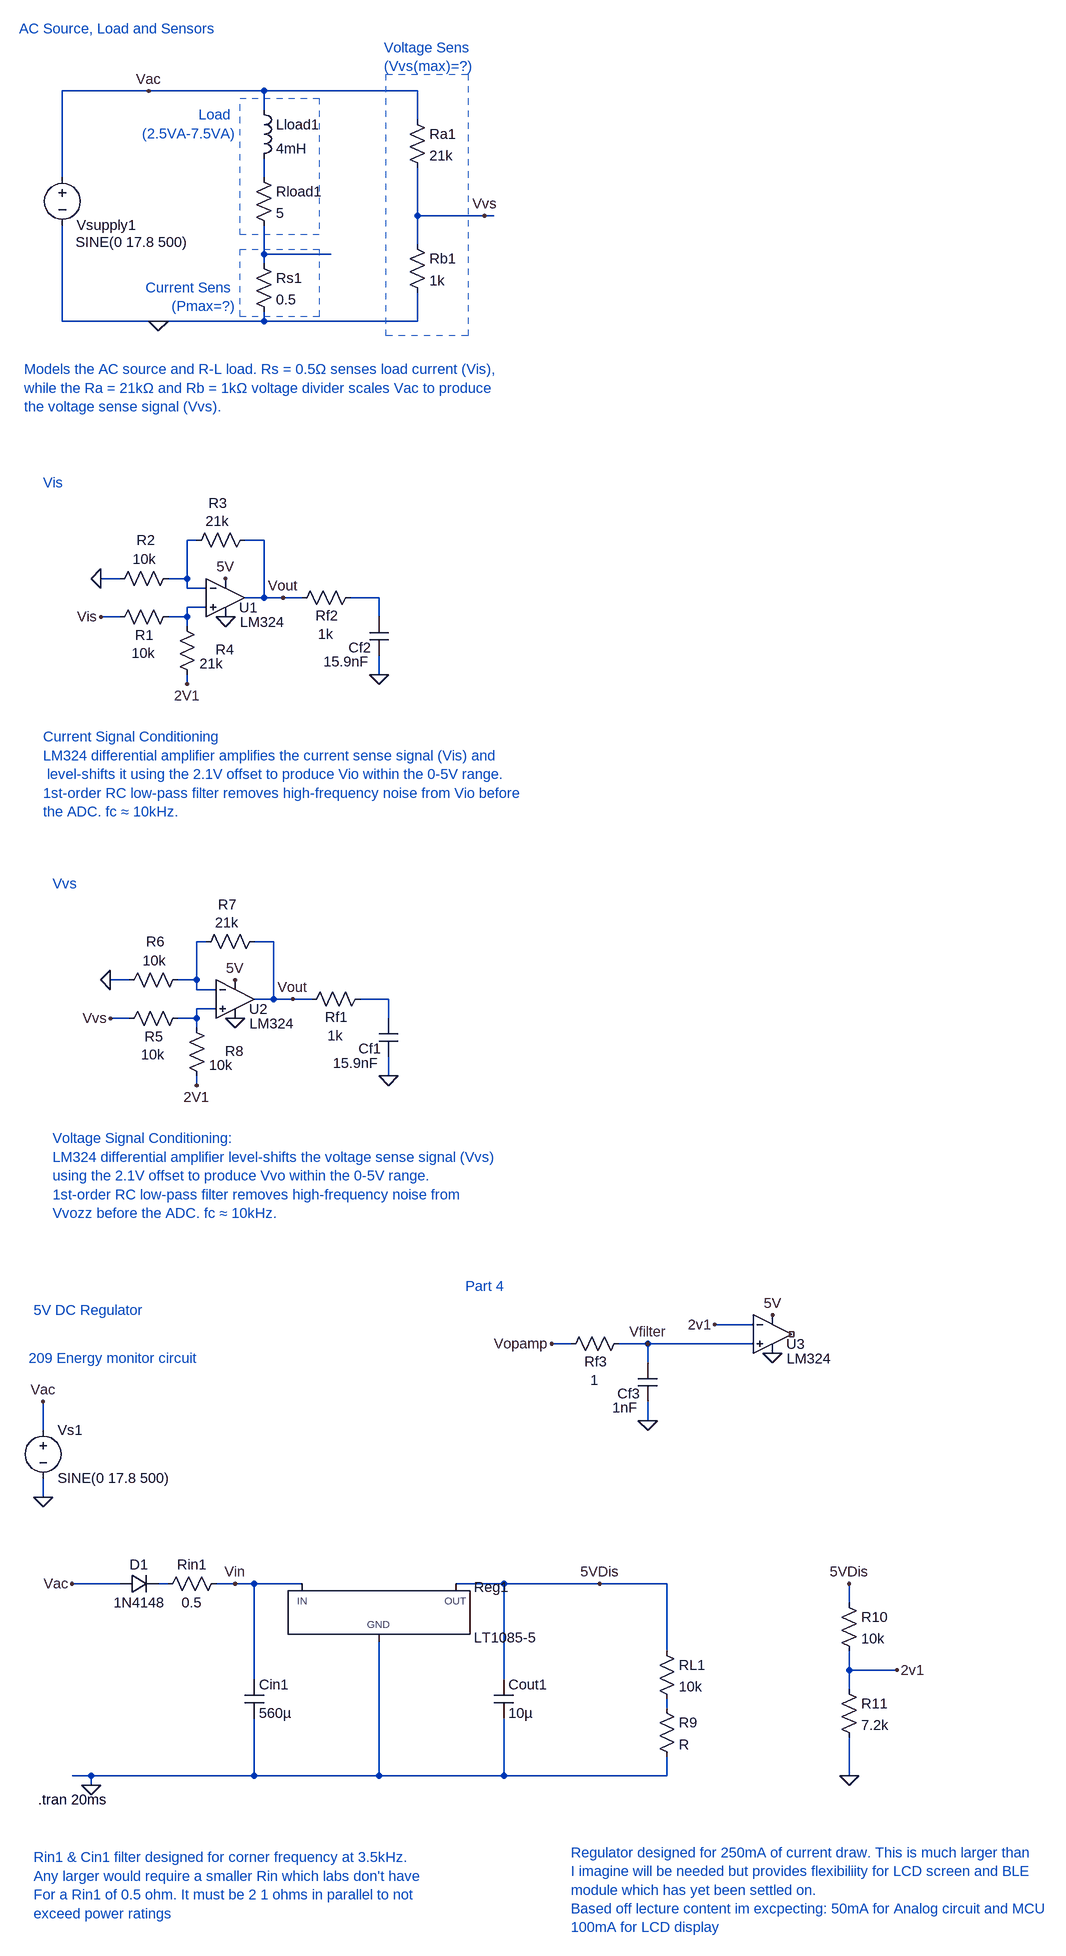
[diagram p0: schematic FinalFinalAnalogDesign.asc]
FinalFinalAnalogDesign.asc, the LTspice schematic file:
Version 4.1
SHEET 1 1692 1584
WIRE -144 -1760 -288 -1760
WIRE 48 -1760 -144 -1760
WIRE 304 -1760 48 -1760
WIRE 48 -1728 48 -1760
WIRE 304 -1712 304 -1760
WIRE -288 -1616 -288 -1760
WIRE 48 -1616 48 -1648
WIRE 304 -1552 304 -1632
WIRE 416 -1552 304 -1552
WIRE 432 -1552 416 -1552
WIRE 304 -1504 304 -1552
WIRE 48 -1488 48 -1536
WIRE 160 -1488 48 -1488
WIRE 48 -1472 48 -1488
WIRE -288 -1376 -288 -1536
WIRE -128 -1376 -288 -1376
WIRE 48 -1376 48 -1392
WIRE 48 -1376 -128 -1376
WIRE 304 -1376 304 -1424
WIRE 304 -1376 48 -1376
WIRE -64 -928 -80 -928
WIRE 48 -928 16 -928
WIRE -192 -864 -224 -864
WIRE -80 -864 -80 -928
WIRE -80 -864 -112 -864
WIRE -80 -848 -80 -864
WIRE -48 -848 -80 -848
WIRE 48 -832 48 -928
WIRE 48 -832 16 -832
WIRE 80 -832 48 -832
WIRE 112 -832 80 -832
WIRE 240 -832 192 -832
WIRE -48 -816 -80 -816
WIRE -192 -800 -224 -800
WIRE -80 -800 -80 -816
WIRE -80 -800 -112 -800
WIRE 240 -800 240 -832
WIRE -80 -784 -80 -800
WIRE 240 -704 240 -736
WIRE -80 -688 -80 -704
WIRE -48 -144 -64 -144
WIRE 64 -144 32 -144
WIRE -176 -80 -208 -80
WIRE -64 -80 -64 -144
WIRE -64 -80 -96 -80
WIRE -64 -64 -64 -80
WIRE -32 -64 -64 -64
WIRE 64 -48 64 -144
WIRE 64 -48 32 -48
WIRE 96 -48 64 -48
WIRE 128 -48 96 -48
WIRE 256 -48 208 -48
WIRE -32 -32 -64 -32
WIRE -176 -16 -208 -16
WIRE -64 -16 -64 -32
WIRE -64 -16 -96 -16
WIRE 256 -16 256 -48
WIRE -64 0 -64 -16
WIRE 256 80 256 48
WIRE -64 96 -64 80
WIRE 864 576 800 576
WIRE 560 608 528 608
WIRE 688 608 640 608
WIRE 864 608 688 608
WIRE 688 640 688 608
WIRE 688 736 688 704
WIRE -320 752 -320 704
WIRE -320 864 -320 832
WIRE -192 1008 -272 1008
WIRE -112 1008 -128 1008
WIRE 0 1008 -32 1008
WIRE 32 1008 0 1008
WIRE 112 1008 32 1008
WIRE 448 1008 368 1008
WIRE 608 1008 448 1008
WIRE 720 1008 608 1008
WIRE 1024 1040 1024 1008
WIRE 720 1120 720 1008
WIRE 1024 1152 1024 1120
WIRE 1104 1152 1024 1152
WIRE 32 1168 32 1008
WIRE 448 1168 448 1008
WIRE 1024 1184 1024 1152
WIRE 720 1216 720 1200
WIRE -240 1328 -272 1328
WIRE 32 1328 32 1232
WIRE 32 1328 -240 1328
WIRE 240 1328 240 1104
WIRE 240 1328 32 1328
WIRE 448 1328 448 1232
WIRE 448 1328 240 1328
WIRE 720 1328 720 1296
WIRE 720 1328 448 1328
WIRE 1024 1328 1024 1264
WIRE -240 1344 -240 1328
FLAG -128 -1376 0
FLAG -144 -1760 Vac
FLAG 416 -1552 Vvs
FLAG -16 -800 0
FLAG -16 -864 5V
FLAG -224 -800 Vis
FLAG -224 -864 0
FLAG -80 -688 2V1
FLAG 0 -16 0
FLAG 0 -80 5V
FLAG -208 -16 Vvs
FLAG -208 -80 0
FLAG -64 96 2V1
FLAG 256 80 0
FLAG 240 -704 0
FLAG 96 -48 Vout
FLAG 80 -832 Vout
FLAG -240 1344 0
FLAG -272 1008 Vac
FLAG 608 1008 5VDis
FLAG 0 1008 Vin
FLAG -320 864 0
FLAG -320 704 Vac
FLAG 688 736 0
FLAG 528 608 Vopamp
FLAG 896 624 0
FLAG 896 560 5V
FLAG 1024 1328 0
FLAG 1024 1008 5VDis
FLAG 1104 1152 2v1
FLAG 688 608 Vfilter
FLAG 800 576 2v1
DATAFLAG 32 1008 ""
SYMBOL voltage -288 -1632 R0
WINDOW 0 24 96 Left 2
WINDOW 3 22 124 Left 2
WINDOW 123 0 0 Left 0
WINDOW 39 0 0 Left 0
SYMATTR InstName Vsupply1
SYMATTR Value SINE(0 17.8 500)
SYMBOL res 32 -1632 R0
SYMATTR InstName Rload1
SYMATTR Value 5
SYMBOL ind 32 -1744 R0
SYMATTR InstName Lload1
SYMATTR Value 4mH
SYMBOL res 32 -1488 R0
SYMATTR InstName Rs1
SYMATTR Value 0.5
SYMBOL res 288 -1728 R0
SYMATTR InstName Ra1
SYMATTR Value 21k
SYMBOL res 288 -1520 R0
SYMATTR InstName Rb1
SYMATTR Value 1k
SYMBOL Opamps/opamp2 -16 -896 R0
WINDOW 0 23 81 Left 2
WINDOW 3 24 105 Left 2
SYMATTR InstName U1
SYMATTR Value LM324
SYMBOL res -96 -816 R90
WINDOW 0 62 55 VBottom 2
WINDOW 3 61 57 VTop 2
SYMATTR InstName R1
SYMATTR Value 10k
SYMBOL res -96 -880 R90
WINDOW 0 -32 53 VBottom 2
WINDOW 3 -32 55 VTop 2
SYMATTR InstName R2
SYMATTR Value 10k
SYMBOL res 32 -944 R90
WINDOW 0 -30 61 VBottom 2
WINDOW 3 -31 62 VTop 2
SYMATTR InstName R3
SYMATTR Value 21k
SYMBOL res -64 -688 R180
WINDOW 0 -62 57 Left 2
WINDOW 3 -44 34 Left 2
SYMATTR InstName R4
SYMATTR Value 21k
SYMBOL Opamps/opamp2 0 -112 R0
WINDOW 0 23 81 Left 2
WINDOW 3 24 105 Left 2
SYMATTR InstName U2
SYMATTR Value LM324
SYMBOL res -80 -32 R90
WINDOW 0 62 55 VBottom 2
WINDOW 3 61 57 VTop 2
SYMATTR InstName R5
SYMATTR Value 10k
SYMBOL res -80 -96 R90
WINDOW 0 -32 53 VBottom 2
WINDOW 3 -32 55 VTop 2
SYMATTR InstName R6
SYMATTR Value 10k
SYMBOL res 48 -160 R90
WINDOW 0 -30 61 VBottom 2
WINDOW 3 -31 62 VTop 2
SYMATTR InstName R7
SYMATTR Value 21k
SYMBOL res -48 96 R180
WINDOW 0 -62 57 Left 2
WINDOW 3 -44 34 Left 2
SYMATTR InstName R8
SYMATTR Value 10k
SYMBOL res 224 -64 R90
WINDOW 0 62 55 VBottom 2
WINDOW 3 61 57 VTop 2
SYMATTR InstName Rf1
SYMATTR Value 1k
SYMBOL cap 272 48 R180
WINDOW 0 29 13 Left 2
WINDOW 3 33 -11 Left 2
SYMATTR InstName Cf1
SYMATTR Value 15.9nF
SYMBOL res 208 -848 R90
WINDOW 0 62 55 VBottom 2
WINDOW 3 61 57 VTop 2
SYMATTR InstName Rf2
SYMATTR Value 1k
SYMBOL cap 256 -736 R180
WINDOW 0 29 13 Left 2
WINDOW 3 33 -11 Left 2
SYMATTR InstName Cf2
SYMATTR Value 15.9nF
SYMBOL voltage -320 736 R0
WINDOW 123 0 0 Left 0
WINDOW 39 0 0 Left 0
SYMATTR InstName Vs1
SYMATTR Value SINE(0 17.8 500)
SYMBOL PowerProducts/LT1085-5 240 1008 R0
SYMATTR InstName Reg1
SYMBOL res 704 1104 R0
SYMATTR InstName RL1
SYMATTR Value 10k
SYMBOL res -16 992 R90
WINDOW 0 0 56 VBottom 2
WINDOW 3 32 56 VTop 2
SYMATTR InstName Rin1
SYMATTR Value 0.5
SYMBOL diode -192 1024 R270
WINDOW 0 32 32 VTop 2
WINDOW 3 0 32 VBottom 2
SYMATTR InstName D1
SYMATTR Value 1N4148
SYMBOL cap 16 1168 R0
SYMATTR InstName Cin1
SYMATTR Value 560µ
SYMATTR SpiceLine Rser=0.001
SYMBOL cap 432 1168 R0
SYMATTR InstName Cout1
SYMATTR Value 10µ
SYMATTR SpiceLine Rser=0.001
SYMBOL res 656 592 R90
WINDOW 0 62 55 VBottom 2
WINDOW 3 61 57 VTop 2
SYMATTR InstName Rf3
SYMATTR Value 1
SYMBOL cap 704 704 R180
WINDOW 0 29 13 Left 2
WINDOW 3 33 -11 Left 2
SYMATTR InstName Cf3
SYMATTR Value 1nF
SYMBOL Opamps/opamp2 896 528 R0
WINDOW 0 23 81 Left 2
WINDOW 3 24 105 Left 2
SYMATTR InstName U3
SYMATTR Value LM324
SYMBOL res 704 1200 R0
SYMATTR InstName R9
SYMBOL res 1008 1024 R0
SYMATTR InstName R10
SYMATTR Value 10k
SYMBOL res 1008 1168 R0
SYMATTR InstName R11
SYMATTR Value 7.2k
TEXT -360 -1864 Left 2 ;AC Source, Load and Sensors
TEXT -352 -1296 Left 2 ;Models the AC source and R-L load. Rs = 0.5Ω senses load current (Vis), \nwhile the Ra = 21kΩ and Rb = 1kΩ voltage divider scales Vac to produce \nthe voltage sense signal (Vvs).
TEXT 0 -1720 Right 2 ;Load \n(2.5VA-7.5VA)
TEXT 0 -1432 Right 2 ;Current Sens \n(Pmax=?)
TEXT 248 -1832 Left 2 ;Voltage Sens\n(Vvs(max)=?)
TEXT -320 -1024 Left 2 ;Vis
TEXT -320 -600 Left 2 ;Current Signal Conditioning\nLM324 differential amplifier amplifies the current sense signal (Vis) and\n level-shifts it using the 2.1V offset to produce Vio within the 0-5V range.\n1st-order RC low-pass filter removes high-frequency noise from Vio before \nthe ADC. fc ≈ 10kHz.
TEXT -304 -240 Left 2 ;Vvs
TEXT -304 184 Left 2 ;Voltage Signal Conditioning:\nLM324 differential amplifier level-shifts the voltage sense signal (Vvs) \nusing the 2.1V offset to produce Vvo within the 0-5V range.\n1st-order RC low-pass filter removes high-frequency noise from \nVvozz before the ADC. fc ≈ 10kHz.
TEXT -336 552 Left 2 ;5V DC Regulator
TEXT -344 632 Left 2 ;209 Energy monitor circuit
TEXT -328 1368 Left 2 !.tran 20ms
TEXT 560 1456 Left 2 ;Regulator designed for 250mA of current draw. This is much larger than\nI imagine will be needed but provides flexibiliity for LCD screen and BLE \nmodule which has yet been settled on. \nBased off lecture content im excpecting: 50mA for Analog circuit and MCU\n100mA for LCD display
TEXT -336 1464 Left 2 ;Rin1 & Cin1 filter designed for corner frequency at 3.5kHz.\nAny larger would require a smaller Rin which labs don't have\nFor a Rin1 of 0.5 ohm. It must be 2 1 ohms in parallel to not \nexceed power ratings
TEXT 384 512 Left 2 ;Part 4
RECTANGLE Normal 252 -1788 388 -1352 2
RECTANGLE Normal 8 -1748 140 -1520 2
RECTANGLE Normal 8 -1496 140 -1384 2

The netlist it stands for:
* FinalFinalAnalogDesign.asc
Vsupply1 Vac 0 SINE(0 17.8 500)
Rload1 N001 N002 5
Lload1 Vac N001 4mH
Rs1 N002 0 0.5
Ra1 Vac Vvs 21k
Rb1 Vvs 0 1k
X§U1 N005 N003 5V 0 Vout LM324  ; pins In+ In- V+ V- OUT
R1 N005 Vis 10k
R2 N003 0 10k
R3 Vout N003 21k
R4 2V1 N005 21k
X§U2 N008 N006 5V 0 Vout LM324  ; pins In+ In- V+ V- OUT
R5 N008 Vvs 10k
R6 N006 0 10k
R7 Vout N006 21k
R8 2V1 N008 10k
Rf1 N007 Vout 1k
Cf1 0 N007 15.9nF
Rf2 N004 Vout 1k
Cf2 0 N004 15.9nF
Vs1 Vac 0 SINE(0 17.8 500)
X§Reg1 0 5VDis Vin LT1085-5  ; pins GND OUT IN
RL1 5VDis N010 10k
Rin1 Vin N009 0.5
D1 Vac N009 1N4148
Cin1 Vin 0 560µ Rser=0.001
Cout1 5VDis 0 10µ Rser=0.001
Rf3 Vfilter Vopamp 1
Cf3 0 Vfilter 1nF
X§U3 Vfilter 2V1 5V 0 NC_01 LM324  ; pins In+ In- V+ V- OUT
R9 N010 0 R
R10 5VDis 2V1 10k
R11 2V1 0 7.2k
.model D D
.lib standard.dio
* AC Source, Load and Sensors
* Models the AC source and R-L load. Rs = 0.5Ω senses load current (Vis),
* while the Ra = 21kΩ and Rb = 1kΩ voltage divider scales Vac to produce
* the voltage sense signal (Vvs).
* Load
* (2.5VA-7.5VA)
* Current Sens
* (Pmax=?)
* Voltage Sens
* (Vvs(max)=?)
* Vis
* Current Signal Conditioning
* LM324 differential amplifier amplifies the current sense signal (Vis) and
*  level-shifts it using the 2.1V offset to produce Vio within the 0-5V range.
* 1st-order RC low-pass filter removes high-frequency noise from Vio before
* the ADC. fc ≈ 10kHz.
* Vvs
* Voltage Signal Conditioning:
* LM324 differential amplifier level-shifts the voltage sense signal (Vvs)
* using the 2.1V offset to produce Vvo within the 0-5V range.
* 1st-order RC low-pass filter removes high-frequency noise from
* Vvozz before the ADC. fc ≈ 10kHz.
* 5V DC Regulator
* 209 Energy monitor circuit
.tran 20ms
* Regulator designed for 250mA of current draw. This is much larger than
* I imagine will be needed but provides flexibiliity for LCD screen and BLE
* module which has yet been settled on.
* Based off lecture content im excpecting: 50mA for Analog circuit and MCU
* 100mA for LCD display
* Rin1 & Cin1 filter designed for corner frequency at 3.5kHz.
* Any larger would require a smaller Rin which labs don't have
* For a Rin1 of 0.5 ohm. It must be 2 1 ohms in parallel to not
* exceed power ratings
* Part 4
.backanno
.end